# Altium schematic sheet mosfet.SchDoc
size A4; SheetNumber: 4; SheetTotal: 7
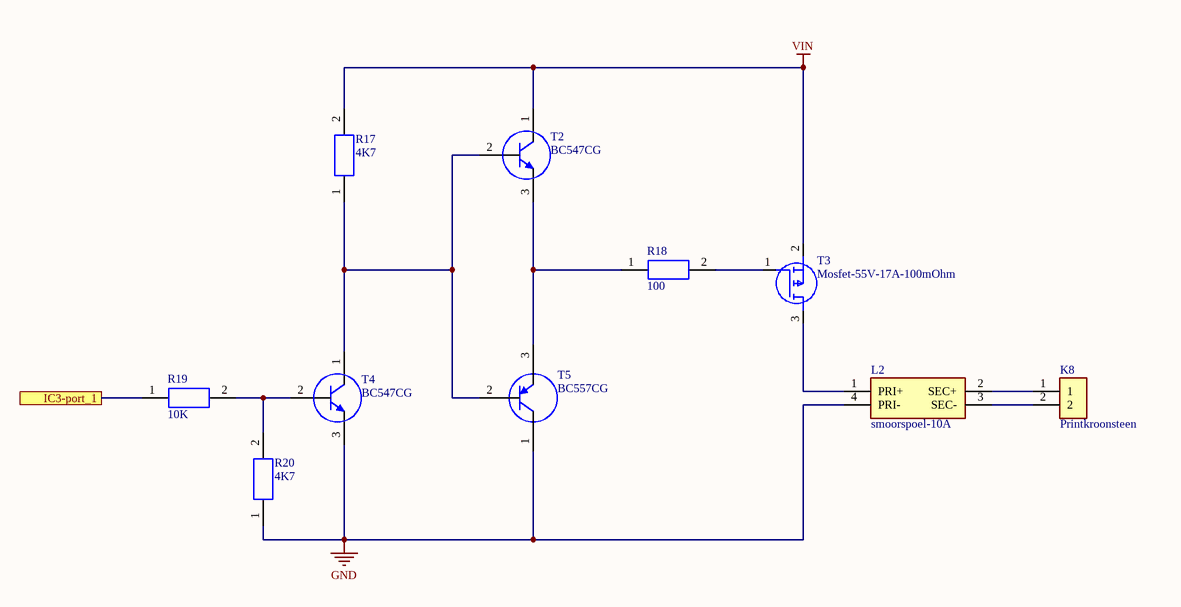
[diagram p0: mosfet.SchDoc]

## Parts
K8  Printkroonsteen  [Printkroonsteen]
L2  smoorspoel-10A  [smoorspoel-10A]
R17  4K7  [R-0805]
R18  100  [R-0805]
R19  10K  [R-0805]
R20  4K7  [R-0805]
T2  BC547CG  [BC547C]
T3  Mosfet-55V-17A-100mOhm  [Mosfet-55V-17A-100mOhm]
T4  BC547CG  [BC547C]
T5  BC557CG  [BC557C]

## Ports
IC3-port_1

## Nets
GND: L2.4(PRI-) R20.1 T4.3(E) T5.1(C)
VIN: R17.2 T2.1(C) T3.2(S)
IC3-port_1: R19.1 ; port IC3-port_1
NetK8_1: K8.1 L2.2(SEC+)
NetK8_2: K8.2 L2.3(SEC-)
NetL2_1: L2.1(PRI+) T3.3(D)
NetR17_1: R17.1 T2.2(B) T4.1(C) T5.2(B)
NetR18_1: R18.1 T2.3(E) T5.3(E)
NetR18_2: R18.2 T3.1(G)
NetR19_2: R19.2 R20.2 T4.2(B)

## Library data of the parts
K8 = Printkroonsteen: Connector; Manufacturer_Name: CUI Inc.; Manufacturer_Part_Number: TB007-508-02BE; Datasheet Link: https://componentsearchengine.com//TB007-508-02BE.pdf; Height: 14mm; Mouser2 Part Number: 490-TB007-508-02BE; Mouser2 Price/Stock: https://www.mouser.com/Search/Refine.aspx?Keyword=490-TB007-508-02BE
L2 = smoorspoel-10A: Transformer; Manufacturer_Name: Laird Technologies; Manufacturer_Part_Number: CM2545X171B-10; Datasheet Link: https://datasheet.datasheetarchive.com/originals/dk/DKDS-7/122753.pdf; Height: 9.5mm
R17-R20 = R-0805: Resistor; Manufacturer_Name: Vishay; Manufacturer_Part_Number: TNPU0805500RAZEN00; Height: 0.55mm
T2 T4 = BC547C: Amplifier Transistor, NPN Silicon, 3-Pin TO-92, Pb-Free, Bulk Box; Manufacturer: On Semiconductor; IC Continuous (A): 0.1; fT Min (MHz): 150; ComponentLink3URL: http://www.onsemi.cn/pub_link/Collateral/2N6426-D.PDF; Mounting Technology: Through Hole; PackageReference: TO-92-3-29-11_AM_SL; ComponentLink2Description: Datasheet; RoHS: TRUE; Packing: Bulk Box; ComponentLink1Description: Manufacturer URL; PackageDescription: 3-Pin Transistor Outline, Body 4.825 x 3.685 mm, Pitch 1.27 mm; PackageVersion: Rev. AM; ComponentLink2URL: http://www.onsemi.com/pub_link/Collateral/BC546-D.PDF; ComponentLink3Description: Package Specification; ComponentLink1URL: http://www.onsemi.com/; DatasheetVersion: Rev. 7; Polarity: NPN; PartNumber: BC547CG
T3 = Mosfet-55V-17A-100mOhm: MOSFET (P-Channel); Manufacturer_Name: Infineon; Manufacturer_Part_Number: IRF9Z34NPBF; Datasheet Link: https://componentsearchengine.com//IRF9Z34NPBF.pdf; Height: 4.69mm; Mouser2 Part Number: 942-IRF9Z34NPBF; Mouser2 Price/Stock: https://www.mouser.com/Search/Refine.aspx?Keyword=942-IRF9Z34NPBF
T5 = BC557C: Amplifier Transistor, PNP Silicon, 3-Pin TO-92, Pb-Free, Bulk Box; Manufacturer: On Semiconductor; IC Continuous (A): -0.1; RoHS: TRUE; DatasheetVersion: Rev. 3; ComponentLink2Description: Datasheet; Packing: Bulk Box; PackageReference: TO-92-3-29-11_AM_SL; ComponentLink3URL: http://www.onsemi.cn/pub_link/Collateral/2N6426-D.PDF; ComponentLink2URL: http://www.onsemi.com/pub_link/Collateral/BC556B-D.PDF; PartNumber: BC557CG; PackageDescription: 3-Pin Transistor Outline, Body 4.825 x 3.685 mm, Pitch 1.27 mm; PackageVersion: Rev. AM; ComponentLink3Description: Package Specification; ComponentLink1URL: http://www.onsemi.com/; ComponentLink1Description: Manufacturer URL; Polarity: PNP; Mounting Technology: Through Hole